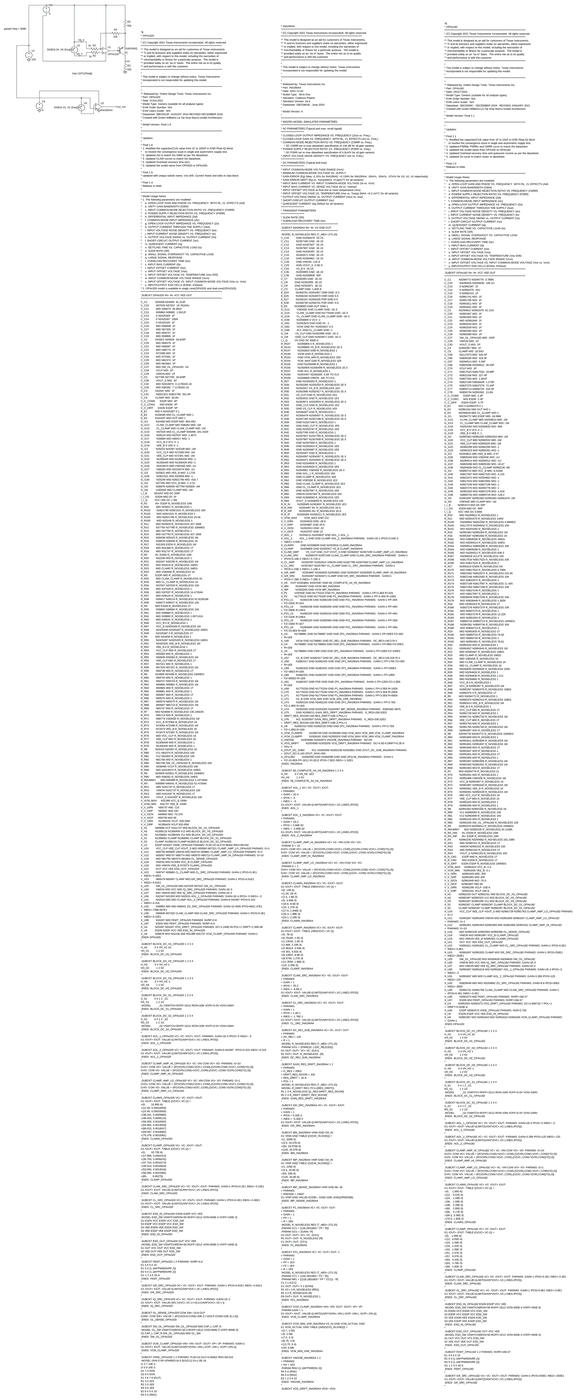
[diagram p0: schematic high_common_mode_shunt_opa320_bjt.asc, whole sheet]
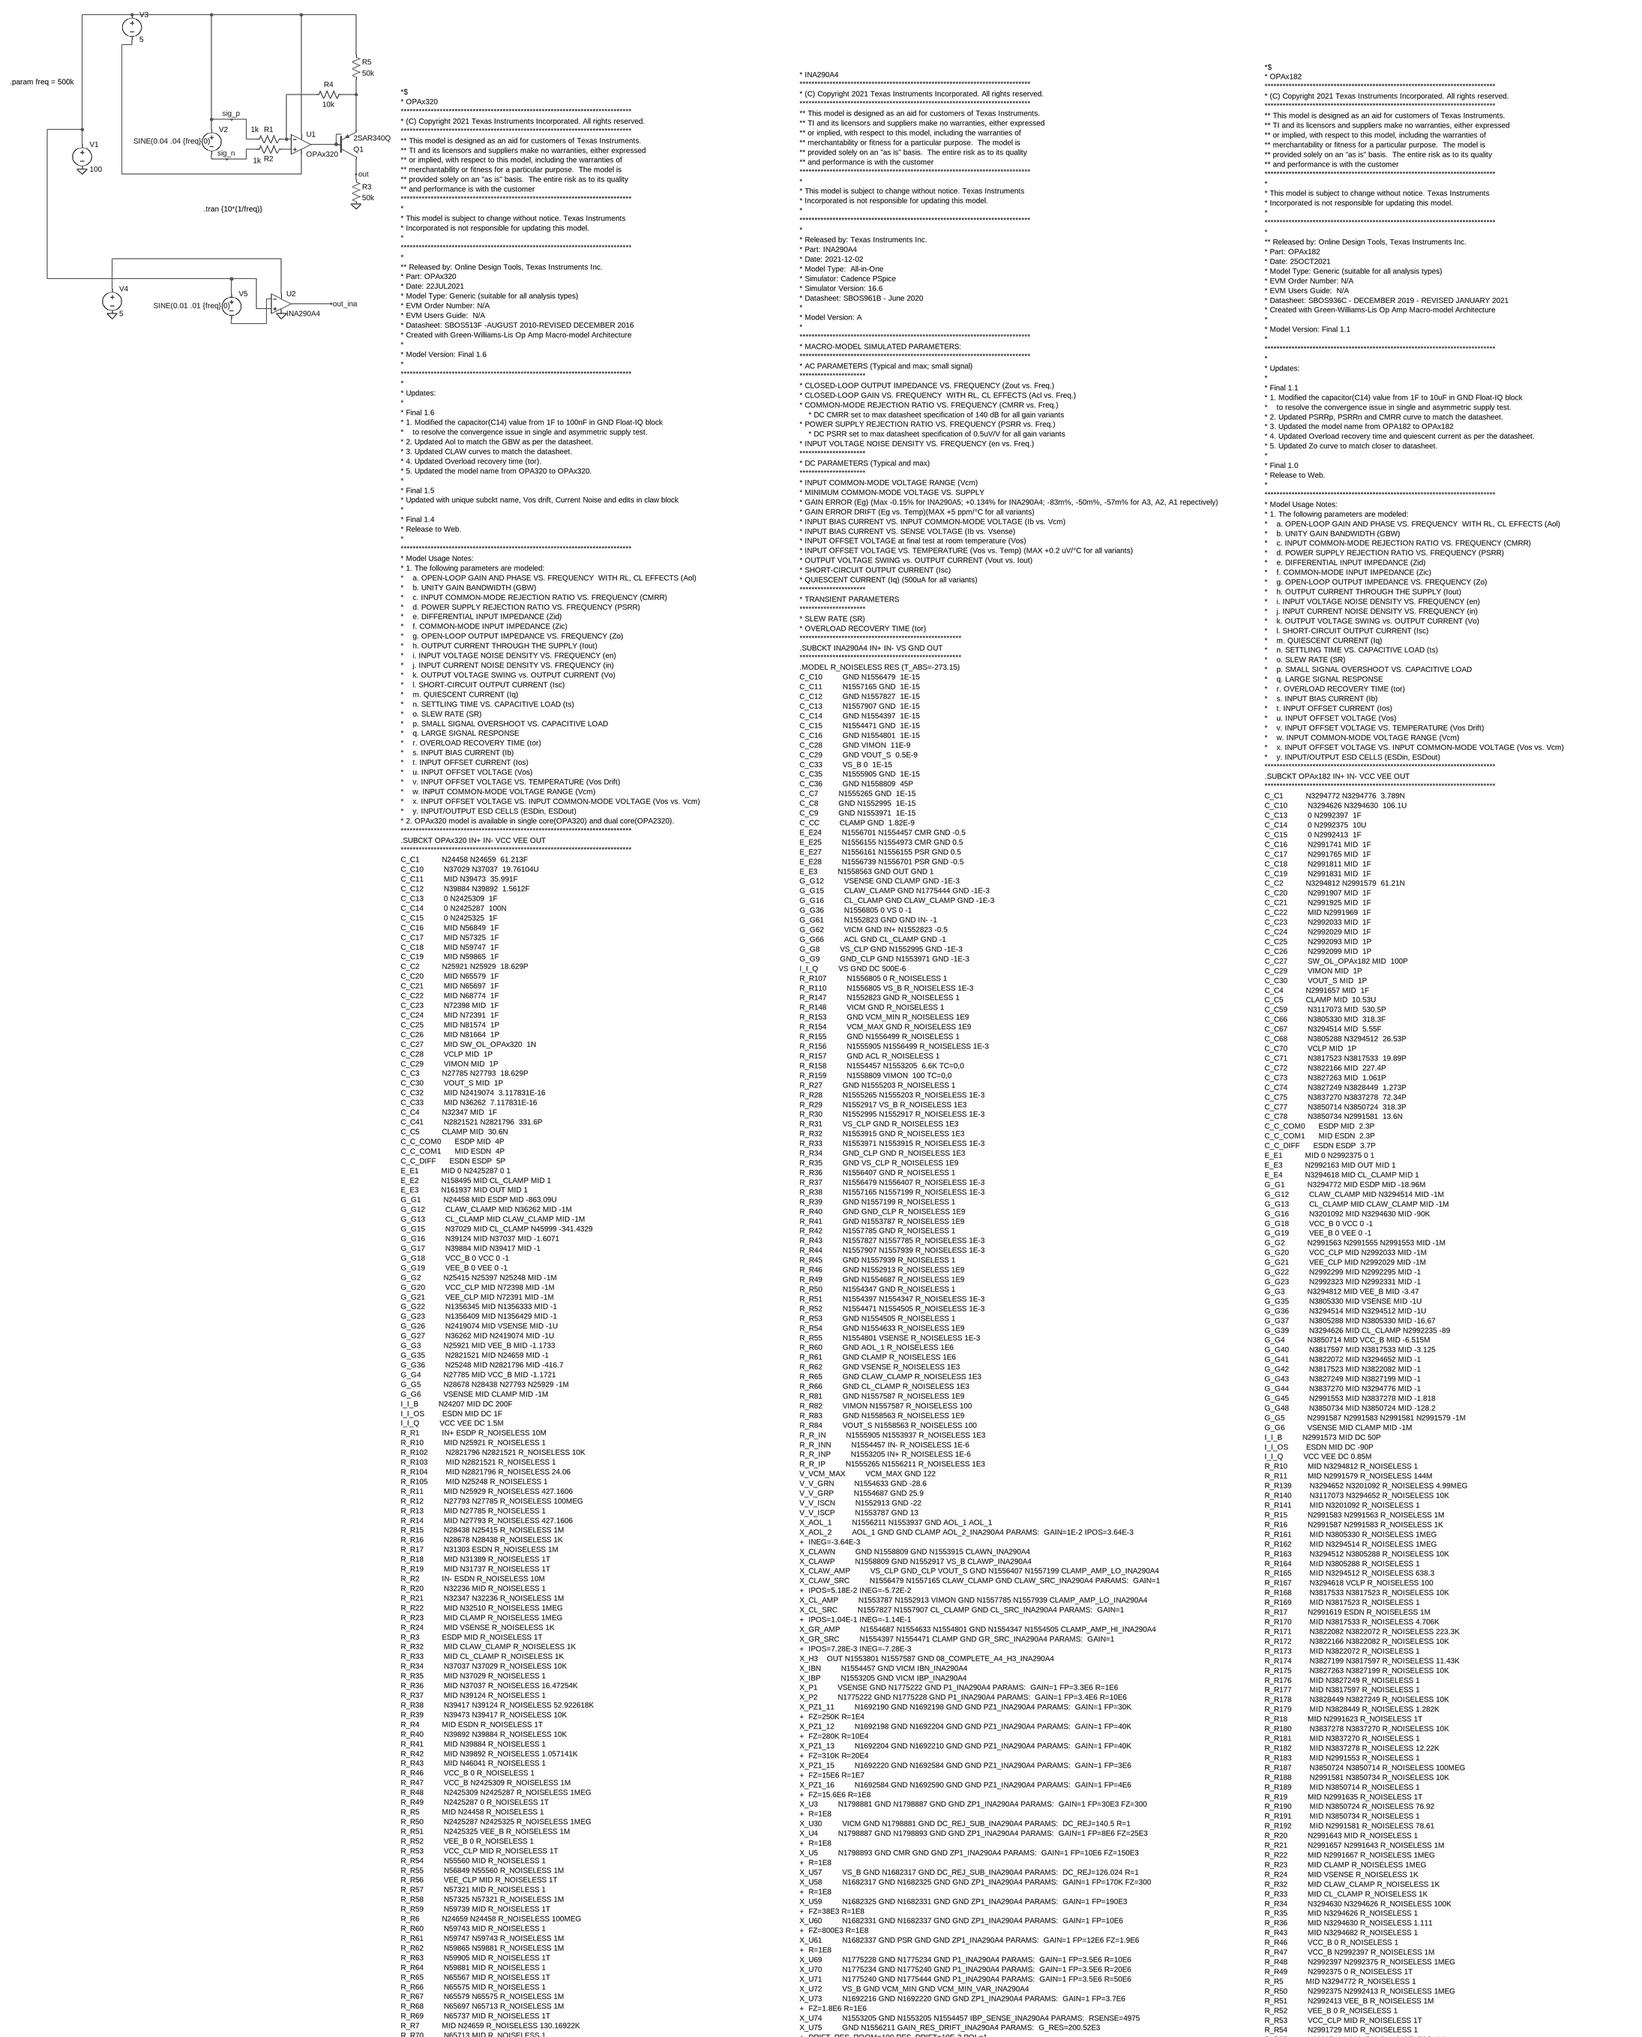
[diagram p1: schematic high_common_mode_shunt_opa320_bjt.asc, part, row 1 of 2, column 1 of 1]
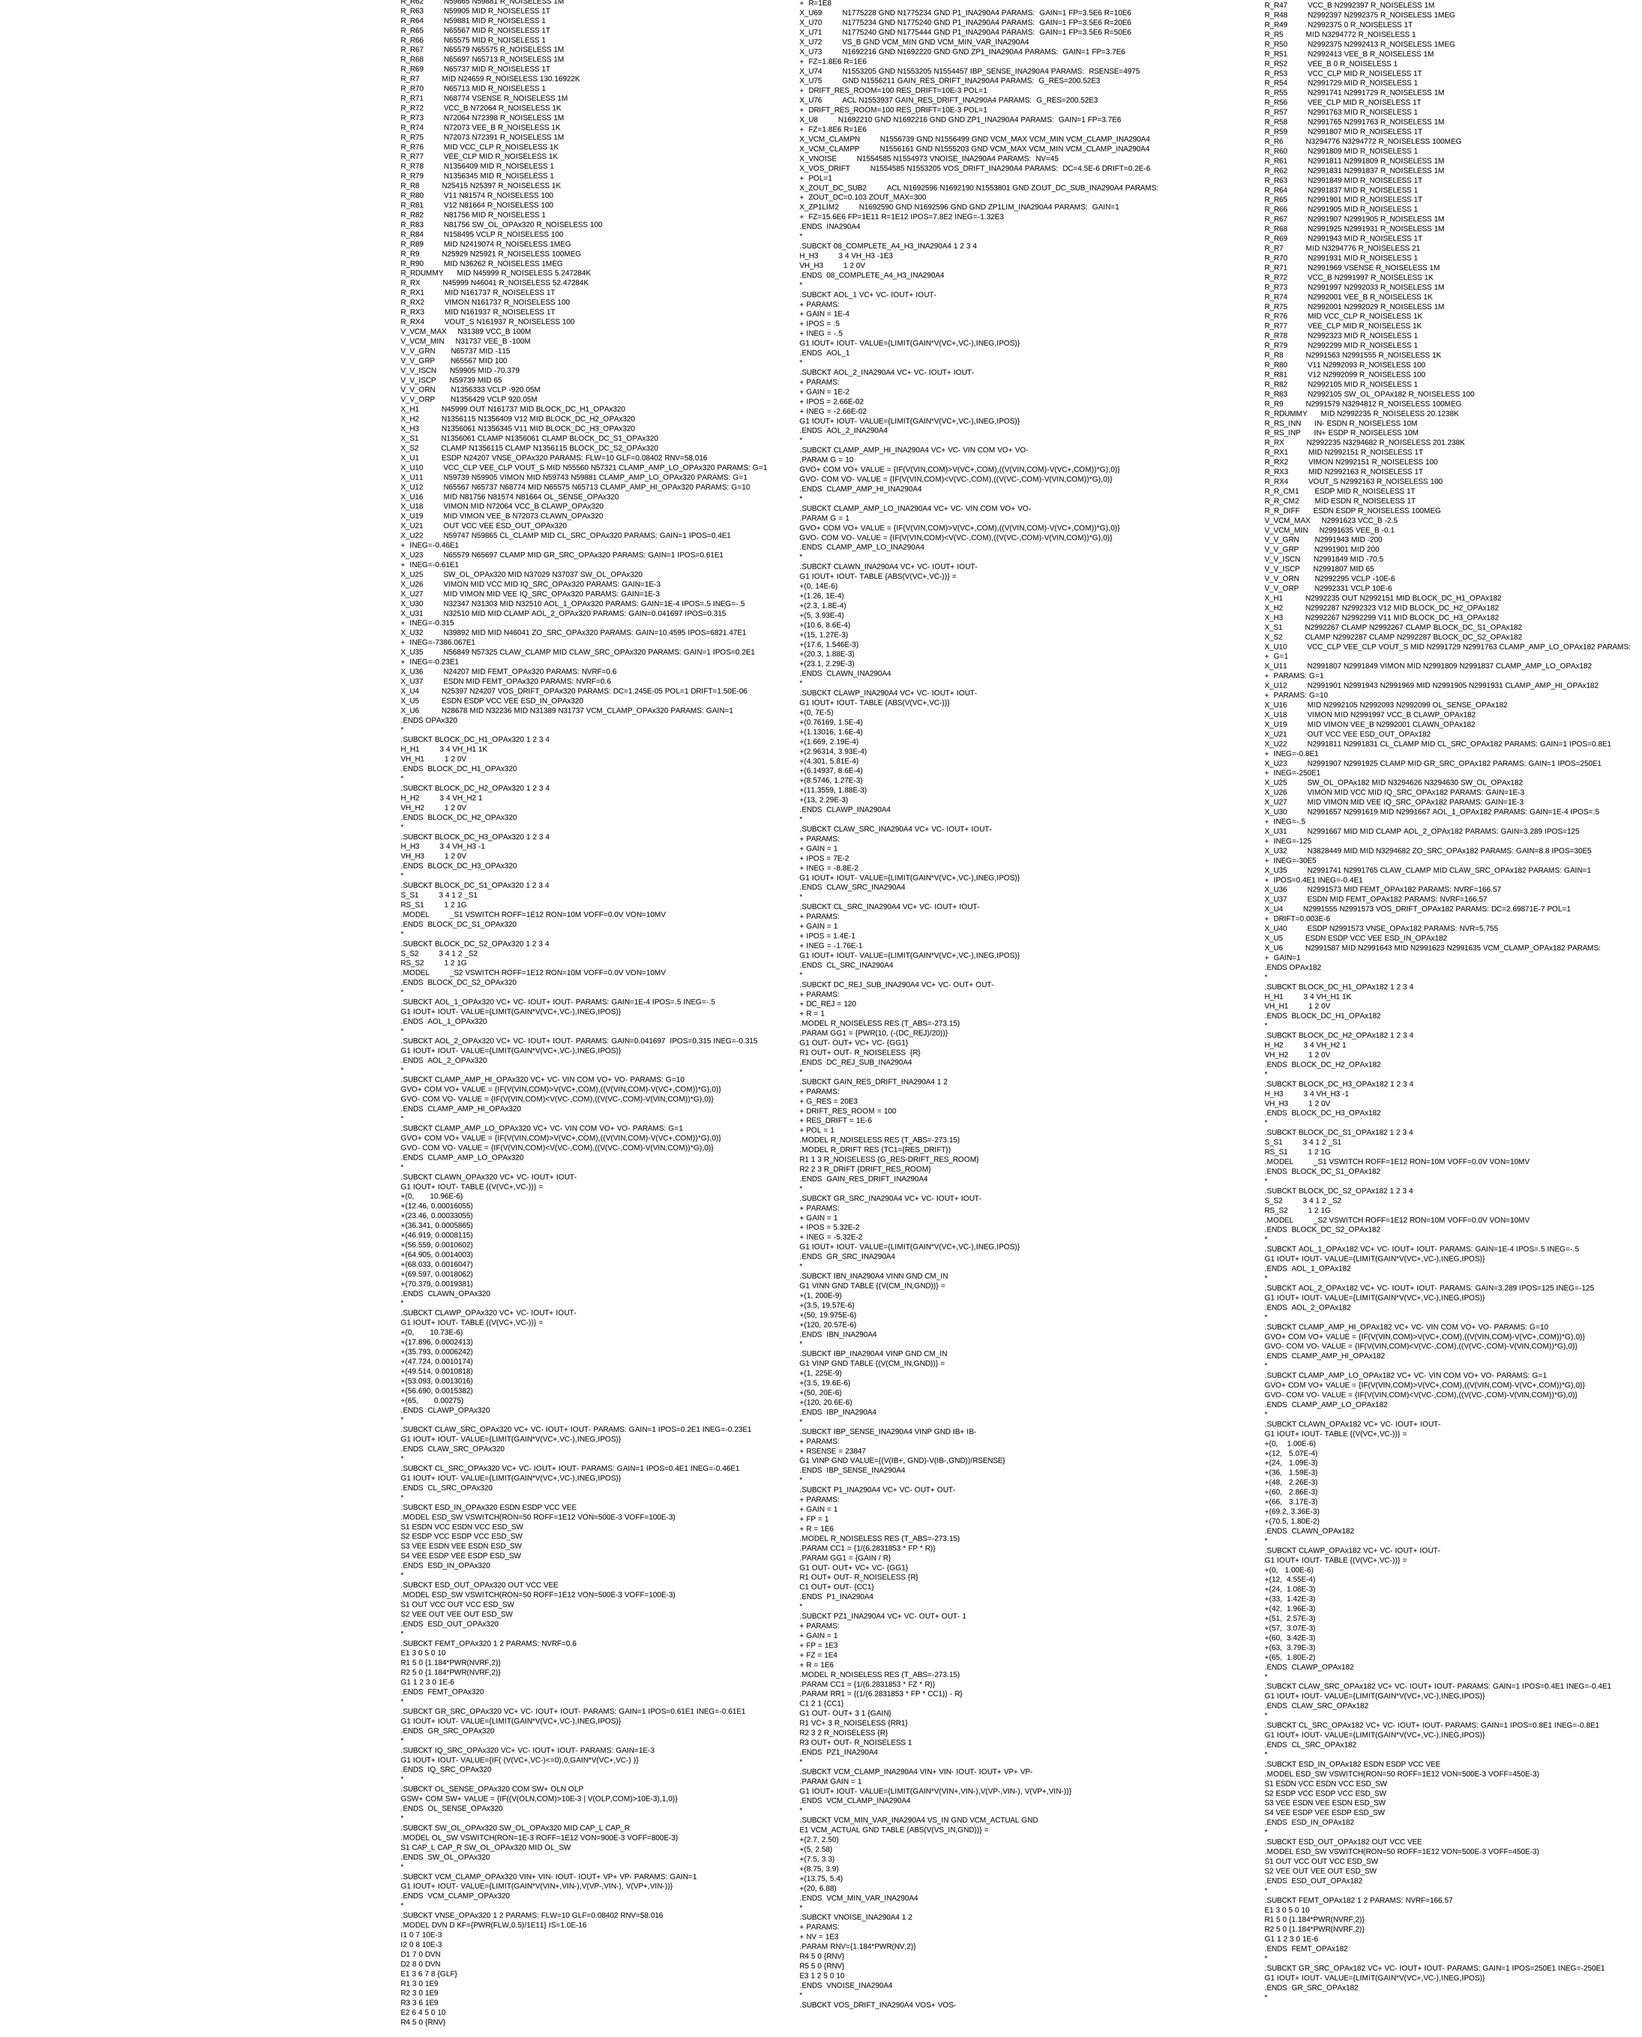
[diagram p2: schematic high_common_mode_shunt_opa320_bjt.asc, part, row 2 of 2, column 1 of 1]
* high_common_mode_shunt_opa320_bjt.asc
XU1 N005 N002 sig_p N001 N004 OPAx320  ; pins In+ In- V+ V- OUT
R1 N002 sig_p 1k
R2 N005 sig_n 1k
V1 sig_p 0 100
V2 sig_p sig_n SINE(0.04 .04 {freq} 0)
R4 N003 N002 10k
V3 sig_p N001 5
R3 out 0 50k
R5 sig_p N003 50k
Q1 out N004 N003 0 2SAR340Q
XU2 sig_p N007 N006 0 out_ina INA290A4  ; pins In+ In- V+ V- OUT
V4 N006 0 5
V5 sig_p N007 SINE(0.01 .01 {freq} 0)
.model NPN NPN
.model PNP PNP
.lib standard.bjt
*$
* OPAx320
*****************************************************************************
* (C) Copyright 2021 Texas Instruments Incorporated. All rights reserved.
*****************************************************************************
** This model is designed as an aid for customers of Texas Instruments.
** TI and its licensors and suppliers make no warranties, either expressed
** or implied, with respect to this model, including the warranties of
** merchantability or fitness for a particular purpose.  The model is
** provided solely on an "as is" basis.  The entire risk as to its quality
** and performance is with the customer
*****************************************************************************
*
* This model is subject to change without notice. Texas Instruments
* Incorporated is not responsible for updating this model.
*
*****************************************************************************
*
** Released by: Online Design Tools, Texas Instruments Inc.
* Part: OPAx320
* Date: 22JUL2021
* Model Type: Generic (suitable for all analysis types)
* EVM Order Number: N/A
* EVM Users Guide:  N/A
* Datasheet: SBOS513F -AUGUST 2010-REVISED DECEMBER 2016
* Created with Green-Williams-Lis Op Amp Macro-model Architecture
*
* Model Version: Final 1.6
*
*****************************************************************************
*
* Updates:
*
* Final 1.6
* 1. Modified the capacitor(C14) value from 1F to 100nF in GND Float-IQ block
*    to resolve the convergence issue in single and asymmetric supply test.
* 2. Updated Aol to match the GBW as per the datasheet.
* 3. Updated CLAW curves to match the datasheet.
* 4. Updated Overload recovery time (tor).
* 5. Updated the model name from OPA320 to OPAx320.
*
* Final 1.5
* Updated with unique subckt name, Vos drift, Current Noise and edits in claw block
*
* Final 1.4
* Release to Web.
*
*****************************************************************************
* Model Usage Notes:
* 1. The following parameters are modeled:
*    a. OPEN-LOOP GAIN AND PHASE VS. FREQUENCY  WITH RL, CL EFFECTS (Aol)
*    b. UNITY GAIN BANDWIDTH (GBW)
*    c. INPUT COMMON-MODE REJECTION RATIO VS. FREQUENCY (CMRR)
*    d. POWER SUPPLY REJECTION RATIO VS. FREQUENCY (PSRR)
*    e. DIFFERENTIAL INPUT IMPEDANCE (Zid)
*    f. COMMON-MODE INPUT IMPEDANCE (Zic)
*    g. OPEN-LOOP OUTPUT IMPEDANCE VS. FREQUENCY (Zo)
*    h. OUTPUT CURRENT THROUGH THE SUPPLY (Iout)
*    i. INPUT VOLTAGE NOISE DENSITY VS. FREQUENCY (en)
*    j. INPUT CURRENT NOISE DENSITY VS. FREQUENCY (in)
*    k. OUTPUT VOLTAGE SWING vs. OUTPUT CURRENT (Vo)
*    l. SHORT-CIRCUIT OUTPUT CURRENT (Isc)
*    m. QUIESCENT CURRENT (Iq)
*    n. SETTLING TIME VS. CAPACITIVE LOAD (ts)
*    o. SLEW RATE (SR)
*    p. SMALL SIGNAL OVERSHOOT VS. CAPACITIVE LOAD
*    q. LARGE SIGNAL RESPONSE
*    r. OVERLOAD RECOVERY TIME (tor)
*    s. INPUT BIAS CURRENT (Ib)
*    t. INPUT OFFSET CURRENT (Ios)
*    u. INPUT OFFSET VOLTAGE (Vos)
*    v. INPUT OFFSET VOLTAGE VS. TEMPERATURE (Vos Drift)
*    w. INPUT COMMON-MODE VOLTAGE RANGE (Vcm)
*    x. INPUT OFFSET VOLTAGE VS. INPUT COMMON-MODE VOLTAGE (Vos vs. Vcm)
*    y. INPUT/OUTPUT ESD CELLS (ESDin, ESDout)
* 2. OPAx320 model is available in single core(OPA320) and dual core(OPA2320).
*****************************************************************************
.SUBCKT OPAx320 IN+ IN- VCC VEE OUT
*****************************************************************************
C_C1          N24458 N24659  61.213F
C_C10         N37029 N37037  19.76104U
C_C11         MID N39473  35.991F
C_C12         N39884 N39892  1.5612F
C_C13         0 N2425309  1F
C_C14         0 N2425287  100N
C_C15         0 N2425325  1F
C_C16         MID N56849  1F
C_C17         MID N57325  1F
C_C18         MID N59747  1F
C_C19         MID N59865  1F
C_C2          N25921 N25929  18.629P
C_C20         MID N65579  1F
C_C21         MID N65697  1F
C_C22         MID N68774  1F
C_C23         N72398 MID  1F
C_C24         MID N72391  1F
C_C25         MID N81574  1P
C_C26         MID N81664  1P
C_C27         MID SW_OL_OPAx320  1N
C_C28         VCLP MID  1P
C_C29         VIMON MID  1P
C_C3          N27785 N27793  18.629P
C_C30         VOUT_S MID  1P
C_C32         MID N2419074  3.117831E-16
C_C33         MID N36262  7.117831E-16
C_C4          N32347 MID  1F
C_C41         N2821521 N2821796  331.6P
C_C5          CLAMP MID  30.6N
C_C_COM0      ESDP MID  4P
C_C_COM1      MID ESDN  4P
C_C_DIFF      ESDN ESDP  5P
E_E1          MID 0 N2425287 0 1
E_E2          N158495 MID CL_CLAMP MID 1
E_E3          N161937 MID OUT MID 1
G_G1          N24458 MID ESDP MID -863.09U
G_G12         CLAW_CLAMP MID N36262 MID -1M
G_G13         CL_CLAMP MID CLAW_CLAMP MID -1M
G_G15         N37029 MID CL_CLAMP N45999 -341.4329
G_G16         N39124 MID N37037 MID -1.6071
G_G17         N39884 MID N39417 MID -1
G_G18         VCC_B 0 VCC 0 -1
G_G19         VEE_B 0 VEE 0 -1
G_G2          N25415 N25397 N25248 MID -1M
G_G20         VCC_CLP MID N72398 MID -1M
G_G21         VEE_CLP MID N72391 MID -1M
G_G22         N1356345 MID N1356333 MID -1
G_G23         N1356409 MID N1356429 MID -1
G_G26         N2419074 MID VSENSE MID -1U
G_G27         N36262 MID N2419074 MID -1U
G_G3          N25921 MID VEE_B MID -1.1733
G_G35         N2821521 MID N24659 MID -1
G_G36         N25248 MID N2821796 MID -416.7
G_G4          N27785 MID VCC_B MID -1.1721
G_G5          N28678 N28438 N27793 N25929 -1M
G_G6          VSENSE MID CLAMP MID -1M
I_I_B         N24207 MID DC 200F
I_I_OS        ESDN MID DC 1F
I_I_Q         VCC VEE DC 1.5M
R_R1          IN+ ESDP R_NOISELESS 10M
R_R10         MID N25921 R_NOISELESS 1
R_R102        N2821796 N2821521 R_NOISELESS 10K
R_R103        MID N2821521 R_NOISELESS 1
R_R104        MID N2821796 R_NOISELESS 24.06
R_R105        MID N25248 R_NOISELESS 1
R_R11         MID N25929 R_NOISELESS 427.1606
R_R12         N27793 N27785 R_NOISELESS 100MEG
R_R13         MID N27785 R_NOISELESS 1
R_R14         MID N27793 R_NOISELESS 427.1606
R_R15         N28438 N25415 R_NOISELESS 1M
R_R16         N28678 N28438 R_NOISELESS 1K
R_R17         N31303 ESDN R_NOISELESS 1M
R_R18         MID N31389 R_NOISELESS 1T
R_R19         MID N31737 R_NOISELESS 1T
R_R2          IN- ESDN R_NOISELESS 10M
R_R20         N32236 MID R_NOISELESS 1
R_R21         N32347 N32236 R_NOISELESS 1M
R_R22         MID N32510 R_NOISELESS 1MEG
R_R23         MID CLAMP R_NOISELESS 1MEG
R_R24         MID VSENSE R_NOISELESS 1K
R_R3          ESDP MID R_NOISELESS 1T
R_R32         MID CLAW_CLAMP R_NOISELESS 1K
R_R33         MID CL_CLAMP R_NOISELESS 1K
R_R34         N37037 N37029 R_NOISELESS 10K
R_R35         MID N37029 R_NOISELESS 1
R_R36         MID N37037 R_NOISELESS 16.47254K
R_R37         MID N39124 R_NOISELESS 1
R_R38         N39417 N39124 R_NOISELESS 52.922618K
R_R39         N39473 N39417 R_NOISELESS 10K
R_R4          MID ESDN R_NOISELESS 1T
R_R40         N39892 N39884 R_NOISELESS 10K
R_R41         MID N39884 R_NOISELESS 1
R_R42         MID N39892 R_NOISELESS 1.057141K
R_R43         MID N46041 R_NOISELESS 1
R_R46         VCC_B 0 R_NOISELESS 1
R_R47         VCC_B N2425309 R_NOISELESS 1M
R_R48         N2425309 N2425287 R_NOISELESS 1MEG
R_R49         N2425287 0 R_NOISELESS 1T
R_R5          MID N24458 R_NOISELESS 1
R_R50         N2425287 N2425325 R_NOISELESS 1MEG
R_R51         N2425325 VEE_B R_NOISELESS 1M
R_R52         VEE_B 0 R_NOISELESS 1
R_R53         VCC_CLP MID R_NOISELESS 1T
R_R54         N55560 MID R_NOISELESS 1
R_R55         N56849 N55560 R_NOISELESS 1M
R_R56         VEE_CLP MID R_NOISELESS 1T
R_R57         N57321 MID R_NOISELESS 1
R_R58         N57325 N57321 R_NOISELESS 1M
R_R59         N59739 MID R_NOISELESS 1T
R_R6          N24659 N24458 R_NOISELESS 100MEG
R_R60         N59743 MID R_NOISELESS 1
R_R61         N59747 N59743 R_NOISELESS 1M
R_R62         N59865 N59881 R_NOISELESS 1M
R_R63         N59905 MID R_NOISELESS 1T
R_R64         N59881 MID R_NOISELESS 1
R_R65         N65567 MID R_NOISELESS 1T
R_R66         N65575 MID R_NOISELESS 1
R_R67         N65579 N65575 R_NOISELESS 1M
R_R68         N65697 N65713 R_NOISELESS 1M
R_R69         N65737 MID R_NOISELESS 1T
R_R7          MID N24659 R_NOISELESS 130.16922K
R_R70         N65713 MID R_NOISELESS 1
R_R71         N68774 VSENSE R_NOISELESS 1M
R_R72         VCC_B N72064 R_NOISELESS 1K
R_R73         N72064 N72398 R_NOISELESS 1M
R_R74         N72073 VEE_B R_NOISELESS 1K
R_R75         N72073 N72391 R_NOISELESS 1M
R_R76         MID VCC_CLP R_NOISELESS 1K
R_R77         VEE_CLP MID R_NOISELESS 1K
R_R78         N1356409 MID R_NOISELESS 1
R_R79         N1356345 MID R_NOISELESS 1
R_R8          N25415 N25397 R_NOISELESS 1K
R_R80         V11 N81574 R_NOISELESS 100
R_R81         V12 N81664 R_NOISELESS 100
R_R82         N81756 MID R_NOISELESS 1
R_R83         N81756 SW_OL_OPAx320 R_NOISELESS 100
R_R84         N158495 VCLP R_NOISELESS 100
R_R89         MID N2419074 R_NOISELESS 1MEG
R_R9          N25929 N25921 R_NOISELESS 100MEG
R_R90         MID N36262 R_NOISELESS 1MEG
R_RDUMMY      MID N45999 R_NOISELESS 5.247284K
R_RX          N45999 N46041 R_NOISELESS 52.47284K
R_RX1         MID N161737 R_NOISELESS 1T
R_RX2         VIMON N161737 R_NOISELESS 100
R_RX3         MID N161937 R_NOISELESS 1T
R_RX4         VOUT_S N161937 R_NOISELESS 100
V_VCM_MAX     N31389 VCC_B 100M
V_VCM_MIN     N31737 VEE_B -100M
V_V_GRN       N65737 MID -115
V_V_GRP       N65567 MID 100
V_V_ISCN      N59905 MID -70.379
V_V_ISCP      N59739 MID 65
V_V_ORN       N1356333 VCLP -920.05M
V_V_ORP       N1356429 VCLP 920.05M
X_H1          N45999 OUT N161737 MID BLOCK_DC_H1_OPAx320
X_H2          N1356115 N1356409 V12 MID BLOCK_DC_H2_OPAx320
X_H3          N1356061 N1356345 V11 MID BLOCK_DC_H3_OPAx320
X_S1          N1356061 CLAMP N1356061 CLAMP BLOCK_DC_S1_OPAx320
X_S2          CLAMP N1356115 CLAMP N1356115 BLOCK_DC_S2_OPAx320
X_U1          ESDP N24207 VNSE_OPAx320 PARAMS: FLW=10 GLF=0.08402 RNV=58.016
X_U10         VCC_CLP VEE_CLP VOUT_S MID N55560 N57321 CLAMP_AMP_LO_OPAx320 PARAMS: G=1
X_U11         N59739 N59905 VIMON MID N59743 N59881 CLAMP_AMP_LO_OPAx320 PARAMS: G=1
X_U12         N65567 N65737 N68774 MID N65575 N65713 CLAMP_AMP_HI_OPAx320 PARAMS: G=10
X_U16         MID N81756 N81574 N81664 OL_SENSE_OPAx320
X_U18         VIMON MID N72064 VCC_B CLAWP_OPAx320
X_U19         MID VIMON VEE_B N72073 CLAWN_OPAx320
X_U21         OUT VCC VEE ESD_OUT_OPAx320
X_U22         N59747 N59865 CL_CLAMP MID CL_SRC_OPAx320 PARAMS: GAIN=1 IPOS=0.4E1
+  INEG=-0.46E1
X_U23         N65579 N65697 CLAMP MID GR_SRC_OPAx320 PARAMS: GAIN=1 IPOS=0.61E1
+  INEG=-0.61E1
X_U25         SW_OL_OPAx320 MID N37029 N37037 SW_OL_OPAx320
X_U26         VIMON MID VCC MID IQ_SRC_OPAx320 PARAMS: GAIN=1E-3
X_U27         MID VIMON MID VEE IQ_SRC_OPAx320 PARAMS: GAIN=1E-3
X_U30         N32347 N31303 MID N32510 AOL_1_OPAx320 PARAMS: GAIN=1E-4 IPOS=.5 INEG=-.5
X_U31         N32510 MID MID CLAMP AOL_2_OPAx320 PARAMS: GAIN=0.041697 IPOS=0.315
+  INEG=-0.315
X_U32         N39892 MID MID N46041 ZO_SRC_OPAx320 PARAMS: GAIN=10.4595 IPOS=6821.47E1
+  INEG=-7386.067E1
X_U35         N56849 N57325 CLAW_CLAMP MID CLAW_SRC_OPAx320 PARAMS: GAIN=1 IPOS=0.2E1
+  INEG=-0.23E1
X_U36         N24207 MID FEMT_OPAx320 PARAMS: NVRF=0.6
X_U37         ESDN MID FEMT_OPAx320 PARAMS: NVRF=0.6
X_U4          N25397 N24207 VOS_DRIFT_OPAx320 PARAMS: DC=1.245E-05 POL=1 DRIFT=1.50E-06
X_U5          ESDN ESDP VCC VEE ESD_IN_OPAx320
X_U6          N28678 MID N32236 MID N31389 N31737 VCM_CLAMP_OPAx320 PARAMS: GAIN=1
.ENDS OPAx320
*
.SUBCKT BLOCK_DC_H1_OPAx320 1 2 3 4
H_H1         3 4 VH_H1 1K
VH_H1         1 2 0V
.ENDS  BLOCK_DC_H1_OPAx320
*
.SUBCKT BLOCK_DC_H2_OPAx320 1 2 3 4
H_H2         3 4 VH_H2 1
VH_H2         1 2 0V
.ENDS  BLOCK_DC_H2_OPAx320
*
.SUBCKT BLOCK_DC_H3_OPAx320 1 2 3 4
H_H3         3 4 VH_H3 -1
VH_H3         1 2 0V
.ENDS  BLOCK_DC_H3_OPAx320
*
.SUBCKT BLOCK_DC_S1_OPAx320 1 2 3 4
S_S1         3 4 1 2 _S1
RS_S1         1 2 1G
.MODEL         _S1 VSWITCH ROFF=1E12 RON=10M VOFF=0.0V VON=10MV
.ENDS  BLOCK_DC_S1_OPAx320
*
.SUBCKT BLOCK_DC_S2_OPAx320 1 2 3 4
S_S2         3 4 1 2 _S2
RS_S2         1 2 1G
.MODEL         _S2 VSWITCH ROFF=1E12 RON=10M VOFF=0.0V VON=10MV
.ENDS  BLOCK_DC_S2_OPAx320
*
.SUBCKT AOL_1_OPAx320 VC+ VC- IOUT+ IOUT- PARAMS: GAIN=1E-4 IPOS=.5 INEG=-.5
G1 IOUT+ IOUT- VALUE={LIMIT(GAIN*V(VC+,VC-),INEG,IPOS)}
.ENDS  AOL_1_OPAx320
*
.SUBCKT AOL_2_OPAx320 VC+ VC- IOUT+ IOUT- PARAMS: GAIN=0.041697  IPOS=0.315 INEG=-0.315
G1 IOUT+ IOUT- VALUE={LIMIT(GAIN*V(VC+,VC-),INEG,IPOS)}
.ENDS  AOL_2_OPAx320
*
.SUBCKT CLAMP_AMP_HI_OPAx320 VC+ VC- VIN COM VO+ VO- PARAMS: G=10
GVO+ COM VO+ VALUE = {IF(V(VIN,COM)>V(VC+,COM),((V(VIN,COM)-V(VC+,COM))*G),0)}
GVO- COM VO- VALUE = {IF(V(VIN,COM)<V(VC-,COM),((V(VC-,COM)-V(VIN,COM))*G),0)}
.ENDS  CLAMP_AMP_HI_OPAx320
*
.SUBCKT CLAMP_AMP_LO_OPAx320 VC+ VC- VIN COM VO+ VO- PARAMS: G=1
GVO+ COM VO+ VALUE = {IF(V(VIN,COM)>V(VC+,COM),((V(VIN,COM)-V(VC+,COM))*G),0)}
GVO- COM VO- VALUE = {IF(V(VIN,COM)<V(VC-,COM),((V(VC-,COM)-V(VIN,COM))*G),0)}
.ENDS  CLAMP_AMP_LO_OPAx320
*
.SUBCKT CLAWN_OPAx320 VC+ VC- IOUT+ IOUT-
G1 IOUT+ IOUT- TABLE {(V(VC+,VC-))} =
+(0,       10.96E-6)
+(12.46, 0.00016055)
+(23.46, 0.00033055)
+(36.341, 0.0005865)
+(46.919, 0.0008115)
+(56.559, 0.0010602)
+(64.905, 0.0014003)
+(68.033, 0.0016047)
+(69.597, 0.0018062)
+(70.379, 0.0019381)
.ENDS  CLAWN_OPAx320
*
.SUBCKT CLAWP_OPAx320 VC+ VC- IOUT+ IOUT-
G1 IOUT+ IOUT- TABLE {(V(VC+,VC-))} =
+(0,       10.73E-6)
+(17.896, 0.0002413)
+(35.793, 0.0006242)
+(47.724, 0.0010174)
+(49.514, 0.0010818)
+(53.093, 0.0013016)
+(56.690, 0.0015382)
+(65,       0.00275)
.ENDS  CLAWP_OPAx320
*
.SUBCKT CLAW_SRC_OPAx320 VC+ VC- IOUT+ IOUT- PARAMS: GAIN=1 IPOS=0.2E1 INEG=-0.23E1
G1 IOUT+ IOUT- VALUE={LIMIT(GAIN*V(VC+,VC-),INEG,IPOS)}
.ENDS  CLAW_SRC_OPAx320
*
.SUBCKT CL_SRC_OPAx320 VC+ VC- IOUT+ IOUT- PARAMS: GAIN=1 IPOS=0.4E1 INEG=-0.46E1
G1 IOUT+ IOUT- VALUE={LIMIT(GAIN*V(VC+,VC-),INEG,IPOS)}
.ENDS  CL_SRC_OPAx320
*
.SUBCKT ESD_IN_OPAx320 ESDN ESDP VCC VEE
.MODEL ESD_SW VSWITCH(RON=50 ROFF=1E12 VON=500E-3 VOFF=100E-3)
S1 ESDN VCC ESDN VCC ESD_SW
S2 ESDP VCC ESDP VCC ESD_SW
S3 VEE ESDN VEE ESDN ESD_SW
S4 VEE ESDP VEE ESDP ESD_SW
.ENDS  ESD_IN_OPAx320
*
.SUBCKT ESD_OUT_OPAx320 OUT VCC VEE
.MODEL ESD_SW VSWITCH(RON=50 ROFF=1E12 VON=500E-3 VOFF=100E-3)
S1 OUT VCC OUT VCC ESD_SW
S2 VEE OUT VEE OUT ESD_SW
.ENDS  ESD_OUT_OPAx320
*
.SUBCKT FEMT_OPAx320 1 2 PARAMS: NVRF=0.6
E1 3 0 5 0 10
R1 5 0 {1.184*PWR(NVRF,2)}
R2 5 0 {1.184*PWR(NVRF,2)}
G1 1 2 3 0 1E-6
.ENDS  FEMT_OPAx320
*
.SUBCKT GR_SRC_OPAx320 VC+ VC- IOUT+ IOUT- PARAMS: GAIN=1 IPOS=0.61E1 INEG=-0.61E1
G1 IOUT+ IOUT- VALUE={LIMIT(GAIN*V(VC+,VC-),INEG,IPOS)}
.ENDS  GR_SRC_OPAx320
*
.SUBCKT IQ_SRC_OPAx320 VC+ VC- IOUT+ IOUT- PARAMS: GAIN=1E-3
G1 IOUT+ IOUT- VALUE={IF( (V(VC+,VC-)<=0),0,GAIN*V(VC+,VC-) )}
.ENDS  IQ_SRC_OPAx320
*
.SUBCKT OL_SENSE_OPAx320 COM SW+ OLN OLP
GSW+ COM SW+ VALUE = {IF((V(OLN,COM)>10E-3 | V(OLP,COM)>10E-3),1,0)}
.ENDS  OL_SENSE_OPAx320
*
.SUBCKT SW_OL_OPAx320 SW_OL_OPAx320 MID CAP_L CAP_R
.MODEL OL_SW VSWITCH(RON=1E-3 ROFF=1E12 VON=900E-3 VOFF=800E-3)
S1 CAP_L CAP_R SW_OL_OPAx320 MID OL_SW
.ENDS  SW_OL_OPAx320
*
.SUBCKT VCM_CLAMP_OPAx320 VIN+ VIN- IOUT- IOUT+ VP+ VP- PARAMS: GAIN=1
G1 IOUT+ IOUT- VALUE={LIMIT(GAIN*V(VIN+,VIN-),V(VP-,VIN-), V(VP+,VIN-))}
.ENDS  VCM_CLAMP_OPAx320
*
.SUBCKT VNSE_OPAx320 1 2 PARAMS: FLW=10 GLF=0.08402 RNV=58.016
.MODEL DVN D KF={PWR(FLW,0.5)/1E11} IS=1.0E-16
I1 0 7 10E-3
I2 0 8 10E-3
D1 7 0 DVN
D2 8 0 DVN
E1 3 6 7 8 {GLF}
R1 3 0 1E9
R2 3 0 1E9
R3 3 6 1E9
E2 6 4 5 0 10
R4 5 0 {RNV}
R5 5 0 {RNV}
R6 3 4 1E9
R7 4 0 1E9
E3 1 2 3 4 1
.ENDS  VNSE_OPAx320
*
.SUBCKT VOS_DRIFT_OPAx320 VOS+ VOS- PARAMS: DC=1.243E-05 POL=1 DRIFT=1.50E-06
E1 VOS+ VOS- VALUE={DC+POL*DRIFT*(TEMP-27)}
.ENDS  VOS_DRIFT_OPAx320
*
.SUBCKT ZO_SRC_OPAx320 VC+ VC- IOUT+ IOUT- PARAMS: GAIN=10.4595 IPOS=6821.47E1 INEG=-7386.067E1
G1 IOUT+ IOUT- VALUE={LIMIT(GAIN*V(VC+,VC-),INEG,IPOS)}
.ENDS  ZO_SRC_OPAx320
*
.MODEL R_NOISELESS RES (T_ABS=-273.15)
*
.tran {10*(1/freq)}
.param freq = 500k
* INA290A4
*****************************************************************************
* (C) Copyright 2021 Texas Instruments Incorporated. All rights reserved.
*****************************************************************************
** This model is designed as an aid for customers of Texas Instruments.
** TI and its licensors and suppliers make no warranties, either expressed
** or implied, with respect to this model, including the warranties of
** merchantability or fitness for a particular purpose.  The model is
** provided solely on an "as is" basis.  The entire risk as to its quality
** and performance is with the customer
*****************************************************************************
*
* This model is subject to change without notice. Texas Instruments
* Incorporated is not responsible for updating this model.
*
*****************************************************************************
*
* Released by: Texas Instruments Inc.
* Part: INA290A4
* Date: 2021-12-02
* Model Type:  All-in-One
* Simulator: Cadence PSpice
* Simulator Version: 16.6
* Datasheet: SBOS961B - June 2020
*
* Model Version: A
*
*****************************************************************************
* MACRO-MODEL SIMULATED PARAMETERS:
*****************************************************************************
* AC PARAMETERS (Typical and max; small signal)
**********************
* CLOSED-LOOP OUTPUT IMPEDANCE VS. FREQUENCY (Zout vs. Freq.)
* CLOSED-LOOP GAIN VS. FREQUENCY  WITH RL, CL EFFECTS (Acl vs. Freq.)
* COMMON-MODE REJECTION RATIO VS. FREQUENCY (CMRR vs. Freq.)
    * DC CMRR set to max datasheet specification of 140 dB for all gain variants
* POWER SUPPLY REJECTION RATIO VS. FREQUENCY (PSRR vs. Freq.)
    * DC PSRR set to max datasheet specification of 0.5uV/V for all gain variants
* INPUT VOLTAGE NOISE DENSITY VS. FREQUENCY (en vs. Freq.)
**********************
* DC PARAMETERS (Typical and max)
**********************
* INPUT COMMON-MODE VOLTAGE RANGE (Vcm)
* MINIMUM COMMON-MODE VOLTAGE VS. SUPPLY
* GAIN ERROR (Eg) (Max -0.15% for INA290A5; +0.134% for INA290A4; -83m%, -50m%, -57m% for A3, A2, A1 repectively)
* GAIN ERROR DRIFT (Eg vs. Temp)(MAX +5 ppm/°C for all variants)
* INPUT BIAS CURRENT VS. INPUT COMMON-MODE VOLTAGE (Ib vs. Vcm)
* INPUT BIAS CURRENT VS. SENSE VOLTAGE (Ib vs. Vsense)
* INPUT OFFSET VOLTAGE at final test at room temperature (Vos)
* INPUT OFFSET VOLTAGE VS. TEMPERATURE (Vos vs. Temp) (MAX +0.2 uV/°C for all variants)
* OUTPUT VOLTAGE SWING vs. OUTPUT CURRENT (Vout vs. Iout)
* SHORT-CIRCUIT OUTPUT CURRENT (Isc)
* QUIESCENT CURRENT (Iq) (500uA for all variants)
**********************
* TRANSIENT PARAMETERS
**********************
* SLEW RATE (SR)
* OVERLOAD RECOVERY TIME (tor)
******************************************************
.SUBCKT INA290A4 IN+ IN- VS GND OUT
******************************************************
.MODEL R_NOISELESS RES (T_ABS=-273.15)
C_C10         GND N1556479  1E-15
C_C11         N1557165 GND  1E-15
C_C12         GND N1557827  1E-15
C_C13         N1557907 GND  1E-15
C_C14         GND N1554397  1E-15
C_C15         N1554471 GND  1E-15
C_C16         GND N1554801  1E-15
C_C28         GND VIMON  11E-9
C_C29         GND VOUT_S  0.5E-9
C_C33         VS_B 0  1E-15
C_C35         N1555905 GND  1E-15
C_C36         GND N1558809  45P
C_C7         N1555265 GND  1E-15
C_C8         GND N1552995  1E-15
C_C9         GND N1553971  1E-15
C_CC         CLAMP GND  1.82E-9
E_E24         N1556701 N1554457 CMR GND -0.5
E_E25         N1556155 N1554973 CMR GND 0.5
E_E27         N1556161 N1556155 PSR GND 0.5
E_E28         N1556739 N1556701 PSR GND -0.5
E_E3         N1558563 GND OUT GND 1
G_G12         VSENSE GND CLAMP GND -1E-3
G_G15         CLAW_CLAMP GND N1775444 GND -1E-3
G_G16         CL_CLAMP GND CLAW_CLAMP GND -1E-3
G_G36         N1556805 0 VS 0 -1
G_G61         N1552823 GND GND IN- -1
G_G62         VICM GND IN+ N1552823 -0.5
G_G66         ACL GND CL_CLAMP GND -1
G_G8         VS_CLP GND N1552995 GND -1E-3
G_G9         GND_CLP GND N1553971 GND -1E-3
I_I_Q         VS GND DC 500E-6
R_R107         N1556805 0 R_NOISELESS 1
R_R110         N1556805 VS_B R_NOISELESS 1E-3
R_R147         N1552823 GND R_NOISELESS 1
R_R148         VICM GND R_NOISELESS 1
R_R153         GND VCM_MIN R_NOISELESS 1E9
R_R154         VCM_MAX GND R_NOISELESS 1E9
R_R155         GND N1556499 R_NOISELESS 1
R_R156         N1555905 N1556499 R_NOISELESS 1E-3
R_R157         GND ACL R_NOISELESS 1
R_R158         N1554457 N1553205  6.6K TC=0,0
R_R159         N1558809 VIMON  100 TC=0,0
R_R27         GND N1555203 R_NOISELESS 1
R_R28         N1555265 N1555203 R_NOISELESS 1E-3
R_R29         N1552917 VS_B R_NOISELESS 1E3
R_R30         N1552995 N1552917 R_NOISELESS 1E-3
R_R31         VS_CLP GND R_NOISELESS 1E3
R_R32         N1553915 GND R_NOISELESS 1E3
R_R33         N1553971 N1553915 R_NOISELESS 1E-3
R_R34         GND_CLP GND R_NOISELESS 1E3
R_R35         GND VS_CLP R_NOISELESS 1E9
R_R36         N1556407 GND R_NOISELESS 1
R_R37         N1556479 N1556407 R_NOISELESS 1E-3
R_R38         N1557165 N1557199 R_NOISELESS 1E-3
R_R39         GND N1557199 R_NOISELESS 1
R_R40         GND GND_CLP R_NOISELESS 1E9
R_R41         GND N1553787 R_NOISELESS 1E9
R_R42         N1557785 GND R_NOISELESS 1
R_R43         N1557827 N1557785 R_NOISELESS 1E-3
R_R44         N1557907 N1557939 R_NOISELESS 1E-3
R_R45         GND N1557939 R_NOISELESS 1
R_R46         GND N1552913 R_NOISELESS 1E9
R_R49         GND N1554687 R_NOISELESS 1E9
R_R50         N1554347 GND R_NOISELESS 1
R_R51         N1554397 N1554347 R_NOISELESS 1E-3
R_R52         N1554471 N1554505 R_NOISELESS 1E-3
R_R53         GND N1554505 R_NOISELESS 1
R_R54         GND N1554633 R_NOISELESS 1E9
R_R55         N1554801 VSENSE R_NOISELESS 1E-3
R_R60         GND AOL_1 R_NOISELESS 1E6
R_R61         GND CLAMP R_NOISELESS 1E6
R_R62         GND VSENSE R_NOISELESS 1E3
R_R65         GND CLAW_CLAMP R_NOISELESS 1E3
R_R66         GND CL_CLAMP R_NOISELESS 1E3
R_R81         GND N1557587 R_NOISELESS 1E9
R_R82         VIMON N1557587 R_NOISELESS 100
R_R83         GND N1558563 R_NOISELESS 1E9
R_R84         VOUT_S N1558563 R_NOISELESS 100
R_R_IN         N1555905 N1553937 R_NOISELESS 1E3
R_R_INN         N1554457 IN- R_NOISELESS 1E-6
R_R_INP         N1553205 IN+ R_NOISELESS 1E-6
R_R_IP         N1555265 N1556211 R_NOISELESS 1E3
V_VCM_MAX         VCM_MAX GND 122
V_V_GRN         N1554633 GND -28.6
V_V_GRP         N1554687 GND 25.9
V_V_ISCN         N1552913 GND -22
V_V_ISCP         N1553787 GND 13
X_AOL_1         N1556211 N1553937 GND AOL_1 AOL_1
X_AOL_2         AOL_1 GND GND CLAMP AOL_2_INA290A4 PARAMS:  GAIN=1E-2 IPOS=3.64E-3
+  INEG=-3.64E-3
X_CLAWN         GND N1558809 GND N1553915 CLAWN_INA290A4
X_CLAWP         N1558809 GND N1552917 VS_B CLAWP_INA290A4
X_CLAW_AMP         VS_CLP GND_CLP VOUT_S GND N1556407 N1557199 CLAMP_AMP_LO_INA290A4
X_CLAW_SRC         N1556479 N1557165 CLAW_CLAMP GND CLAW_SRC_INA290A4 PARAMS:  GAIN=1
+  IPOS=5.18E-2 INEG=-5.72E-2
X_CL_AMP         N1553787 N1552913 VIMON GND N1557785 N1557939 CLAMP_AMP_LO_INA290A4
X_CL_SRC         N1557827 N1557907 CL_CLAMP GND CL_SRC_INA290A4 PARAMS:  GAIN=1
+  IPOS=1.04E-1 INEG=-1.14E-1
X_GR_AMP         N1554687 N1554633 N1554801 GND N1554347 N1554505 CLAMP_AMP_HI_INA290A4
X_GR_SRC         N1554397 N1554471 CLAMP GND GR_SRC_INA290A4 PARAMS:  GAIN=1
+  IPOS=7.28E-3 INEG=-7.28E-3
X_H3    OUT N1553801 N1557587 GND 08_COMPLETE_A4_H3_INA290A4
X_IBN         N1554457 GND VICM IBN_INA290A4
X_IBP         N1553205 GND VICM IBP_INA290A4
X_P1         VSENSE GND N1775222 GND P1_INA290A4 PARAMS:  GAIN=1 FP=3.3E6 R=1E6
X_P2         N1775222 GND N1775228 GND P1_INA290A4 PARAMS:  GAIN=1 FP=3.4E6 R=10E6
X_PZ1_11         N1692190 GND N1692198 GND GND PZ1_INA290A4 PARAMS:  GAIN=1 FP=30K
+  FZ=250K R=1E4
X_PZ1_12         N1692198 GND N1692204 GND GND PZ1_INA290A4 PARAMS:  GAIN=1 FP=40K
+  FZ=280K R=10E4
X_PZ1_13         N1692204 GND N1692210 GND GND PZ1_INA290A4 PARAMS:  GAIN=1 FP=40K
+  FZ=310K R=20E4
X_PZ1_15         N1692220 GND N1692584 GND GND PZ1_INA290A4 PARAMS:  GAIN=1 FP=3E6
+  FZ=15E6 R=1E7
X_PZ1_16         N1692584 GND N1692590 GND GND PZ1_INA290A4 PARAMS:  GAIN=1 FP=4E6
+  FZ=15.6E6 R=1E8
X_U3         N1798881 GND N1798887 GND GND ZP1_INA290A4 PARAMS:  GAIN=1 FP=30E3 FZ=300
+  R=1E8
X_U30         VICM GND N1798881 GND DC_REJ_SUB_INA290A4 PARAMS:  DC_REJ=140.5 R=1
X_U4         N1798887 GND N1798893 GND GND ZP1_INA290A4 PARAMS:  GAIN=1 FP=8E6 FZ=25E3
+  R=1E8
X_U5         N1798893 GND CMR GND GND ZP1_INA290A4 PARAMS:  GAIN=1 FP=10E6 FZ=150E3
+  R=1E8
X_U57         VS_B GND N1682317 GND DC_REJ_SUB_INA290A4 PARAMS:  DC_REJ=126.024 R=1
X_U58         N1682317 GND N1682325 GND GND ZP1_INA290A4 PARAMS:  GAIN=1 FP=170K FZ=300
+  R=1E8
X_U59         N1682325 GND N1682331 GND GND ZP1_INA290A4 PARAMS:  GAIN=1 FP=190E3
+  FZ=38E3 R=1E8
X_U60         N1682331 GND N1682337 GND GND ZP1_INA290A4 PARAMS:  GAIN=1 FP=10E6
+  FZ=800E3 R=1E8
X_U61         N1682337 GND PSR GND GND ZP1_INA290A4 PARAMS:  GAIN=1 FP=12E6 FZ=1.9E6
+  R=1E8
X_U69         N1775228 GND N1775234 GND P1_INA290A4 PARAMS:  GAIN=1 FP=3.5E6 R=10E6
X_U70         N1775234 GND N1775240 GND P1_INA290A4 PARAMS:  GAIN=1 FP=3.5E6 R=20E6
X_U71         N1775240 GND N1775444 GND P1_INA290A4 PARAMS:  GAIN=1 FP=3.5E6 R=50E6
X_U72         VS_B GND VCM_MIN GND VCM_MIN_VAR_INA290A4
X_U73         N1692216 GND N1692220 GND GND ZP1_INA290A4 PARAMS:  GAIN=1 FP=3.7E6
+  FZ=1.8E6 R=1E6
X_U74         N1553205 GND N1553205 N1554457 IBP_SENSE_INA290A4 PARAMS:  RSENSE=4975
X_U75         GND N1556211 GAIN_RES_DRIFT_INA290A4 PARAMS:  G_RES=200.52E3
+  DRIFT_RES_ROOM=100 RES_DRIFT=10E-3 POL=1
X_U76         ACL N1553937 GAIN_RES_DRIFT_INA290A4 PARAMS:  G_RES=200.52E3
+  DRIFT_RES_ROOM=100 RES_DRIFT=10E-3 POL=1
X_U8         N1692210 GND N1692216 GND GND ZP1_INA290A4 PARAMS:  GAIN=1 FP=3.7E6
+  FZ=1.8E6 R=1E6
X_VCM_CLAMPN         N1556739 GND N1556499 GND VCM_MAX VCM_MIN VCM_CLAMP_INA290A4
X_VCM_CLAMPP         N1556161 GND N1555203 GND VCM_MAX VCM_MIN VCM_CLAMP_INA290A4
X_VNOISE         N1554585 N1554973 VNOISE_INA290A4 PARAMS:  NV=45
X_VOS_DRIFT         N1554585 N1553205 VOS_DRIFT_INA290A4 PARAMS:  DC=4.5E-6 DRIFT=0.2E-6
+  POL=1
X_ZOUT_DC_SUB2         ACL N1692596 N1692190 N1553801 GND ZOUT_DC_SUB_INA290A4 PARAMS:
+  ZOUT_DC=0.103 ZOUT_MAX=300
X_ZP1LIM2         N1692590 GND N1692596 GND GND ZP1LIM_INA290A4 PARAMS:  GAIN=1
+  FZ=15.6E6 FP=1E11 R=1E12 IPOS=7.8E2 INEG=-1.32E3
.ENDS  INA290A4
*
.SUBCKT 08_COMPLETE_A4_H3_INA290A4 1 2 3 4
H_H3         3 4 VH_H3 -1E3
VH_H3         1 2 0V
.ENDS  08_COMPLETE_A4_H3_INA290A4
*
.SUBCKT AOL_1 VC+ VC- IOUT+ IOUT-
+ PARAMS:
+ GAIN = 1E-4
+ IPOS = .5
+ INEG = -.5
G1 IOUT+ IOUT- VALUE={LIMIT(GAIN*V(VC+,VC-),INEG,IPOS)}
.ENDS  AOL_1
*
.SUBCKT AOL_2_INA290A4 VC+ VC- IOUT+ IOUT-
+ PARAMS:
+ GAIN = 1E-2
+ IPOS = 2.66E-02
+ INEG = -2.66E-02
G1 IOUT+ IOUT- VALUE={LIMIT(GAIN*V(VC+,VC-),INEG,IPOS)}
.ENDS  AOL_2_INA290A4
*
.SUBCKT CLAMP_AMP_HI_INA290A4 VC+ VC- VIN COM VO+ VO-
.PARAM G = 10
GVO+ COM VO+ VALUE = {IF(V(VIN,COM)>V(VC+,COM),((V(VIN,COM)-V(VC+,COM))*G),0)}
GVO- COM VO- VALUE = {IF(V(VIN,COM)<V(VC-,COM),((V(VC-,COM)-V(VIN,COM))*G),0)}
.ENDS  CLAMP_AMP_HI_INA290A4
*
.SUBCKT CLAMP_AMP_LO_INA290A4 VC+ VC- VIN COM VO+ VO-
.PARAM G = 1
GVO+ COM VO+ VALUE = {IF(V(VIN,COM)>V(VC+,COM),((V(VIN,COM)-V(VC+,COM))*G),0)}
GVO- COM VO- VALUE = {IF(V(VIN,COM)<V(VC-,COM),((V(VC-,COM)-V(VIN,COM))*G),0)}
.ENDS  CLAMP_AMP_LO_INA290A4
*
.SUBCKT CLAWN_INA290A4 VC+ VC- IOUT+ IOUT-
G1 IOUT+ IOUT- TABLE {ABS(V(VC+,VC-))} =
+(0, 14E-6)
+(1.26, 1E-4)
+(2.3, 1.8E-4)
+(5, 3.93E-4)
+(10.6, 8.6E-4)
+(15, 1.27E-3)
+(17.6, 1.546E-3)
+(20.3, 1.88E-3)
+(23.1, 2.29E-3)
.ENDS  CLAWN_INA290A4
*
.SUBCKT CLAWP_INA290A4 VC+ VC- IOUT+ IOUT-
G1 IOUT+ IOUT- TABLE {ABS(V(VC+,VC-))}
+(0, 7E-5)
+(0.76169, 1.5E-4)
+(1.13016, 1.6E-4)
+(1.669, 2.19E-4)
+(2.96314, 3.93E-4)
+(4.301, 5.81E-4)
+(6.14937, 8.6E-4)
+(8.5746, 1.27E-3)
+(11.3559, 1.88E-3)
+(13, 2.29E-3)
.ENDS  CLAWP_INA290A4
*
.SUBCKT CLAW_SRC_INA290A4 VC+ VC- IOUT+ IOUT-
+ PARAMS:
+ GAIN = 1
+ IPOS = 7E-2
+ INEG = -8.8E-2
G1 IOUT+ IOUT- VALUE={LIMIT(GAIN*V(VC+,VC-),INEG,IPOS)}
.ENDS  CLAW_SRC_INA290A4
*
.SUBCKT CL_SRC_INA290A4 VC+ VC- IOUT+ IOUT-
+ PARAMS:
+ GAIN = 1
+ IPOS = 1.4E-1
+ INEG = -1.76E-1
G1 IOUT+ IOUT- VALUE={LIMIT(GAIN*V(VC+,VC-),INEG,IPOS)}
.ENDS  CL_SRC_INA290A4
*
.SUBCKT DC_REJ_SUB_INA290A4 VC+ VC- OUT+ OUT-
+ PARAMS:
+ DC_REJ = 120
+ R = 1
.MODEL R_NOISELESS RES (T_ABS=-273.15)
.PARAM GG1 = {PWR(10, (-(DC_REJ)/20))}
G1 OUT- OUT+ VC+ VC- {GG1}
R1 OUT+ OUT- R_NOISELESS  {R}
.ENDS  DC_REJ_SUB_INA290A4
*
.SUBCKT GAIN_RES_DRIFT_INA290A4 1 2
+ PARAMS:
+ G_RES = 20E3
+ DRIFT_RES_ROOM = 100
+ RES_DRIFT = 1E-6
+ POL = 1
.MODEL R_NOISELESS RES (T_ABS=-273.15)
.MODEL R_DRIFT RES (TC1={RES_DRIFT})
R1 1 3 R_NOISELESS {G_RES-DRIFT_RES_ROOM}
R2 2 3 R_DRIFT {DRIFT_RES_ROOM}
.ENDS  GAIN_RES_DRIFT_INA290A4
*
.SUBCKT GR_SRC_INA290A4 VC+ VC- IOUT+ IOUT-
+ PARAMS:
+ GAIN = 1
+ IPOS = 5.32E-2
+ INEG = -5.32E-2
G1 IOUT+ IOUT- VALUE={LIMIT(GAIN*V(VC+,VC-),INEG,IPOS)}
.ENDS  GR_SRC_INA290A4
*
.SUBCKT IBN_INA290A4 VINN GND CM_IN
G1 VINN GND TABLE {(V(CM_IN,GND))} =
+(1, 200E-9)
+(3.5, 19.57E-6)
+(50, 19.975E-6)
+(120, 20.57E-6)
.ENDS  IBN_INA290A4
*
.SUBCKT IBP_INA290A4 VINP GND CM_IN
G1 VINP GND TABLE {(V(CM_IN,GND))} =
+(1, 225E-9)
+(3.5, 19.6E-6)
+(50, 20E-6)
+(120, 20.6E-6)
.ENDS  IBP_INA290A4
*
.SUBCKT IBP_SENSE_INA290A4 VINP GND IB+ IB-
+ PARAMS:
+ RSENSE = 23847
G1 VINP GND VALUE={(V(IB+, GND)-V(IB-,GND))/RSENSE}
.ENDS  IBP_SENSE_INA290A4
*
.SUBCKT P1_INA290A4 VC+ VC- OUT+ OUT-
+ PARAMS:
+ GAIN = 1
+ FP = 1
+ R = 1E6
.MODEL R_NOISELESS RES (T_ABS=-273.15)
.PARAM CC1 = {1/(6.2831853 * FP * R)}
.PARAM GG1 = {GAIN / R}
G1 OUT- OUT+ VC+ VC- {GG1}
R1 OUT+ OUT- R_NOISELESS {R}
C1 OUT+ OUT- {CC1}
.ENDS  P1_INA290A4
*
.SUBCKT PZ1_INA290A4 VC+ VC- OUT+ OUT- 1
+ PARAMS:
+ GAIN = 1
+ FP = 1E3
+ FZ = 1E4
+ R = 1E6
.MODEL R_NOISELESS RES (T_ABS=-273.15)
.PARAM CC1 = {1/(6.2831853 * FZ * R)}
.PARAM RR1 = {(1/(6.2831853 * FP * CC1)) - R}
C1 2 1 {CC1}
G1 OUT- OUT+ 3 1 {GAIN}
R1 VC+ 3 R_NOISELESS {RR1}
R2 3 2 R_NOISELESS {R}
R3 OUT+ OUT- R_NOISELESS 1
.ENDS  PZ1_INA290A4
*
.SUBCKT VCM_CLAMP_INA290A4 VIN+ VIN- IOUT- IOUT+ VP+ VP-
.PARAM GAIN = 1
G1 IOUT+ IOUT- VALUE={LIMIT(GAIN*V(VIN+,VIN-),V(VP-,VIN-), V(VP+,VIN-))}
.ENDS  VCM_CLAMP_INA290A4
*
.SUBCKT VCM_MIN_VAR_INA290A4 VS_IN GND VCM_ACTUAL GND
E1 VCM_ACTUAL GND TABLE {ABS(V(VS_IN,GND))} =
+(2.7, 2.50)
+(5, 2.58)
+(7.5, 3.3)
+(8.75, 3.9)
+(13.75, 5.4)
+(20, 6.88)
.ENDS  VCM_MIN_VAR_INA290A4
*
.SUBCKT VNOISE_INA290A4 1 2
+ PARAMS:
+ NV = 1E3
.PARAM RNV={1.184*PWR(NV,2)}
R4 5 0 {RNV}
R5 5 0 {RNV}
E3 1 2 5 0 10
.ENDS  VNOISE_INA290A4
*
.SUBCKT VOS_DRIFT_INA290A4 VOS+ VOS-
+ PARAMS:
+ DC = 20E-6
+ DRIFT = 1E-6
+ POL = 1
E1 VOS+ VOS- VALUE={DC+POL*DRIFT*(TEMP-27)}
.ENDS  VOS_DRIFT_INA290A4
*
.SUBCKT ZOUT_DC_SUB_INA290A4 INA INB OUTA OUTB COM
+ PARAMS:
+ ZOUT_DC = 1
+ ZOUT_MAX = 1E3
.MODEL R_NOISELESS RES (T_ABS=-273.15)
.PARAM BETA = 1
.PARAM RDUMMY = {10*ZOUT_MAX}
.PARAM RX = {100*ZOUT_MAX}
.PARAM G1 = {RX/(ZOUT_DC*BETA)}
G1 COM OUTA INA OUTB {G1}
R1 OUTA COM R_NOISELESS 1
RDUMMY OUTB COM R_NOISELESS {RDUMMY}
RX INB OUTB R_NOISELESS {RX}
.ENDS  ZOUT_DC_SUB_INA290A4
*
.SUBCKT ZP1_INA290A4 VC+ VC- OUT+ OUT- 1
+ PARAMS:
+ GAIN = 1
+ FZ = 1E3
+ FP = 1E4
+ R = 1E6
.MODEL R_NOISELESS RES (T_ABS=-273.15)
.PARAM GG1 = {GAIN * FP/FZ}
.PARAM CC1 = {1/(6.2831853 * FZ * R)}
.PARAM RR1 = {R/(FP/FZ - 1)}
C1 VC+ 2 {CC1}
G1 OUT- OUT+ 2 1 {GG1}
R1 VC+ 2 R_NOISELESS {R}
R2 2 1 R_NOISELESS {RR1}
R3 OUT+ OUT- R_NOISELESS 1
.ENDS  ZP1_INA290A4
*
.SUBCKT ZP1LIM_INA290A4 VC+ VC- OUT+ OUT- 1
+ PARAMS:
+ GAIN = 1
+ FZ = 1E3
+ FP = 1E4
+ R = 1E6
+ IPOS = 1.72E3
+ INEG = -2.9E3
.MODEL R_NOISELESS RES (T_ABS=-273.15)
.PARAM GG1 = {GAIN * FP/FZ}
.PARAM CC1 = {1/(6.2831853 * FZ * R)}
.PARAM RR1 = {R/(FP/FZ - 1)}
C1 VC+ 2 {CC1}
G1 OUT- OUT+ VALUE={LIMIT(GG1 * V(2, 1), INEG, IPOS)}
R1 VC+ 2 R_NOISELESS {R}
R2 2 1 R_NOISELESS {RR1}
R3 OUT+ OUT- R_NOISELESS 1
.ENDS  ZP1LIM_INA290A4
*
*$
* OPAx182
*****************************************************************************
* (C) Copyright 2021 Texas Instruments Incorporated. All rights reserved.
*****************************************************************************
** This model is designed as an aid for customers of Texas Instruments.
** TI and its licensors and suppliers make no warranties, either expressed
** or implied, with respect to this model, including the warranties of
** merchantability or fitness for a particular purpose.  The model is
** provided solely on an "as is" basis.  The entire risk as to its quality
** and performance is with the customer
*****************************************************************************
*
* This model is subject to change without notice. Texas Instruments
* Incorporated is not responsible for updating this model.
*
*****************************************************************************
*
** Released by: Online Design Tools, Texas Instruments Inc.
* Part: OPAx182
* Date: 25OCT2021
* Model Type: Generic (suitable for all analysis types)
* EVM Order Number: N/A
* EVM Users Guide:  N/A
* Datasheet: SBOS936C - DECEMBER 2019 - REVISED JANUARY 2021
* Created with Green-Williams-Lis Op Amp Macro-model Architecture
*
* Model Version: Final 1.1
*
*****************************************************************************
*
* Updates:
*
* Final 1.1
* 1. Modified the capacitor(C14) value from 1F to 10uF in GND Float-IQ block
*    to resolve the convergence issue in single and asymmetric supply test.
* 2. Updated PSRRp, PSRRn and CMRR curve to match the datasheet.
* 3. Updated the model name from OPA182 to OPAx182
* 4. Updated Overload recovery time and quiescent current as per the datasheet.
* 5. Updated Zo curve to match closer to datasheet.
*
* Final 1.0
* Release to Web.
*
*****************************************************************************
* Model Usage Notes:
* 1. The following parameters are modeled:
*    a. OPEN-LOOP GAIN AND PHASE VS. FREQUENCY  WITH RL, CL EFFECTS (Aol)
*    b. UNITY GAIN BANDWIDTH (GBW)
*    c. INPUT COMMON-MODE REJECTION RATIO VS. FREQUENCY (CMRR)
*    d. POWER SUPPLY REJECTION RATIO VS. FREQUENCY (PSRR)
*    e. DIFFERENTIAL INPUT IMPEDANCE (Zid)
*    f. COMMON-MODE INPUT IMPEDANCE (Zic)
*    g. OPEN-LOOP OUTPUT IMPEDANCE VS. FREQUENCY (Zo)
*    h. OUTPUT CURRENT THROUGH THE SUPPLY (Iout)
*    i. INPUT VOLTAGE NOISE DENSITY VS. FREQUENCY (en)
*    j. INPUT CURRENT NOISE DENSITY VS. FREQUENCY (in)
*    k. OUTPUT VOLTAGE SWING vs. OUTPUT CURRENT (Vo)
*    l. SHORT-CIRCUIT OUTPUT CURRENT (Isc)
*    m. QUIESCENT CURRENT (Iq)
*    n. SETTLING TIME VS. CAPACITIVE LOAD (ts)
*    o. SLEW RATE (SR)
*    p. SMALL SIGNAL OVERSHOOT VS. CAPACITIVE LOAD
*    q. LARGE SIGNAL RESPONSE
*    r. OVERLOAD RECOVERY TIME (tor)
*    s. INPUT BIAS CURRENT (Ib)
*    t. INPUT OFFSET CURRENT (Ios)
*    u. INPUT OFFSET VOLTAGE (Vos)
*    v. INPUT OFFSET VOLTAGE VS. TEMPERATURE (Vos Drift)
*    w. INPUT COMMON-MODE VOLTAGE RANGE (Vcm)
*    x. INPUT OFFSET VOLTAGE VS. INPUT COMMON-MODE VOLTAGE (Vos vs. Vcm)
*    y. INPUT/OUTPUT ESD CELLS (ESDin, ESDout)
*****************************************************************************
.SUBCKT OPAx182 IN+ IN- VCC VEE OUT
*****************************************************************************
C_C1          N3294772 N3294776  3.789N
C_C10         N3294626 N3294630  106.1U
C_C13         0 N2992397  1F
C_C14         0 N2992375  10U
C_C15         0 N2992413  1F
C_C16         N2991741 MID  1F
C_C17         N2991765 MID  1F
C_C18         N2991811 MID  1F
C_C19         N2991831 MID  1F
C_C2          N3294812 N2991579  61.21N
C_C20         N2991907 MID  1F
C_C21         N2991925 MID  1F
C_C22         MID N2991969  1F
C_C23         N2992033 MID  1F
C_C24         N2992029 MID  1F
C_C25         N2992093 MID  1P
C_C26         N2992099 MID  1P
C_C27         SW_OL_OPAx182 MID  100P
C_C29         VIMON MID  1P
C_C30         VOUT_S MID  1P
C_C4          N2991657 MID  1F
C_C5          CLAMP MID  10.53U
C_C59         N3117073 MID  530.5P
C_C66         N3805330 MID  318.3F
C_C67         N3294514 MID  5.55F
C_C68         N3805288 N3294512  26.53P
C_C70         VCLP MID  1P
C_C71         N3817523 N3817533  19.89P
C_C72         N3822166 MID  227.4P
C_C73         N3827263 MID  1.061P
C_C74         N3827249 N3828449  1.273P
C_C75         N3837270 N3837278  72.34P
C_C77         N3850714 N3850724  318.3P
C_C78         N3850734 N2991581  13.6N
C_C_COM0      ESDP MID  2.3P
C_C_COM1      MID ESDN  2.3P
C_C_DIFF      ESDN ESDP  3.7P
E_E1          MID 0 N2992375 0 1
E_E3          N2992163 MID OUT MID 1
E_E4          N3294618 MID CL_CLAMP MID 1
G_G1          N3294772 MID ESDP MID -18.96M
G_G12         CLAW_CLAMP MID N3294514 MID -1M
G_G13         CL_CLAMP MID CLAW_CLAMP MID -1M
G_G16         N3201092 MID N3294630 MID -90K
G_G18         VCC_B 0 VCC 0 -1
G_G19         VEE_B 0 VEE 0 -1
G_G2          N2991563 N2991555 N2991553 MID -1M
G_G20         VCC_CLP MID N2992033 MID -1M
G_G21         VEE_CLP MID N2992029 MID -1M
G_G22         N2992299 MID N2992295 MID -1
G_G23         N2992323 MID N2992331 MID -1
G_G3          N3294812 MID VEE_B MID -3.47
G_G35         N3805330 MID VSENSE MID -1U
G_G36         N3294514 MID N3294512 MID -1U
G_G37         N3805288 MID N3805330 MID -16.67
G_G39         N3294626 MID CL_CLAMP N2992235 -89
G_G4          N3850714 MID VCC_B MID -6.515M
G_G40         N3817597 MID N3817533 MID -3.125
G_G41         N3822072 MID N3294652 MID -1
G_G42         N3817523 MID N3822082 MID -1
G_G43         N3827249 MID N3827199 MID -1
G_G44         N3837270 MID N3294776 MID -1
G_G45         N2991553 MID N3837278 MID -1.818
G_G48         N3850734 MID N3850724 MID -128.2
G_G5          N2991587 N2991583 N2991581 N2991579 -1M
G_G6          VSENSE MID CLAMP MID -1M
I_I_B         N2991573 MID DC 50P
I_I_OS        ESDN MID DC -90P
I_I_Q         VCC VEE DC 0.85M
R_R10         MID N3294812 R_NOISELESS 1
R_R11         MID N2991579 R_NOISELESS 144M
R_R139        N3294652 N3201092 R_NOISELESS 4.99MEG
R_R140        N3117073 N3294652 R_NOISELESS 10K
R_R141        MID N3201092 R_NOISELESS 1
R_R15         N2991583 N2991563 R_NOISELESS 1M
R_R16         N2991587 N2991583 R_NOISELESS 1K
R_R161        MID N3805330 R_NOISELESS 1MEG
R_R162        MID N3294514 R_NOISELESS 1MEG
R_R163        N3294512 N3805288 R_NOISELESS 10K
R_R164        MID N3805288 R_NOISELESS 1
R_R165        MID N3294512 R_NOISELESS 638.3
R_R167        N3294618 VCLP R_NOISELESS 100
R_R168        N3817533 N3817523 R_NOISELESS 10K
R_R169        MID N3817523 R_NOISELESS 1
R_R17         N2991619 ESDN R_NOISELESS 1M
R_R170        MID N3817533 R_NOISELESS 4.706K
R_R171        N3822082 N3822072 R_NOISELESS 223.3K
R_R172        N3822166 N3822082 R_NOISELESS 10K
R_R173        MID N3822072 R_NOISELESS 1
R_R174        N3827199 N3817597 R_NOISELESS 11.43K
R_R175        N3827263 N3827199 R_NOISELESS 10K
R_R176        MID N3827249 R_NOISELESS 1
R_R177        MID N3817597 R_NOISELESS 1
R_R178        N3828449 N3827249 R_NOISELESS 10K
R_R179        MID N3828449 R_NOISELESS 1.282K
R_R18         MID N2991623 R_NOISELESS 1T
R_R180        N3837278 N3837270 R_NOISELESS 10K
R_R181        MID N3837270 R_NOISELESS 1
R_R182        MID N3837278 R_NOISELESS 12.22K
R_R183        MID N2991553 R_NOISELESS 1
R_R187        N3850724 N3850714 R_NOISELESS 100MEG
R_R188        N2991581 N3850734 R_NOISELESS 10K
R_R189        MID N3850714 R_NOISELESS 1
R_R19         MID N2991635 R_NOISELESS 1T
R_R190        MID N3850724 R_NOISELESS 76.92
R_R191        MID N3850734 R_NOISELESS 1
R_R192        MID N2991581 R_NOISELESS 78.61
R_R20         N2991643 MID R_NOISELESS 1
R_R21         N2991657 N2991643 R_NOISELESS 1M
R_R22         MID N2991667 R_NOISELESS 1MEG
R_R23         MID CLAMP R_NOISELESS 1MEG
R_R24         MID VSENSE R_NOISELESS 1K
R_R32         MID CLAW_CLAMP R_NOISELESS 1K
R_R33         MID CL_CLAMP R_NOISELESS 1K
R_R34         N3294630 N3294626 R_NOISELESS 100K
R_R35         MID N3294626 R_NOISELESS 1
R_R36         MID N3294630 R_NOISELESS 1.111
R_R43         MID N3294682 R_NOISELESS 1
R_R46         VCC_B 0 R_NOISELESS 1
R_R47         VCC_B N2992397 R_NOISELESS 1M
R_R48         N2992397 N2992375 R_NOISELESS 1MEG
R_R49         N2992375 0 R_NOISELESS 1T
R_R5          MID N3294772 R_NOISELESS 1
R_R50         N2992375 N2992413 R_NOISELESS 1MEG
R_R51         N2992413 VEE_B R_NOISELESS 1M
R_R52         VEE_B 0 R_NOISELESS 1
R_R53         VCC_CLP MID R_NOISELESS 1T
R_R54         N2991729 MID R_NOISELESS 1
R_R55         N2991741 N2991729 R_NOISELESS 1M
R_R56         VEE_CLP MID R_NOISELESS 1T
R_R57         N2991763 MID R_NOISELESS 1
R_R58         N2991765 N2991763 R_NOISELESS 1M
R_R59         N2991807 MID R_NOISELESS 1T
R_R6          N3294776 N3294772 R_NOISELESS 100MEG
R_R60         N2991809 MID R_NOISELESS 1
R_R61         N2991811 N2991809 R_NOISELESS 1M
R_R62         N2991831 N2991837 R_NOISELESS 1M
R_R63         N2991849 MID R_NOISELESS 1T
R_R64         N2991837 MID R_NOISELESS 1
R_R65         N2991901 MID R_NOISELESS 1T
R_R66         N2991905 MID R_NOISELESS 1
R_R67         N2991907 N2991905 R_NOISELESS 1M
R_R68         N2991925 N2991931 R_NOISELESS 1M
R_R69         N2991943 MID R_NOISELESS 1T
R_R7          MID N3294776 R_NOISELESS 21
R_R70         N2991931 MID R_NOISELESS 1
R_R71         N2991969 VSENSE R_NOISELESS 1M
R_R72         VCC_B N2991997 R_NOISELESS 1K
R_R73         N2991997 N2992033 R_NOISELESS 1M
R_R74         N2992001 VEE_B R_NOISELESS 1K
R_R75         N2992001 N2992029 R_NOISELESS 1M
R_R76         MID VCC_CLP R_NOISELESS 1K
R_R77         VEE_CLP MID R_NOISELESS 1K
R_R78         N2992323 MID R_NOISELESS 1
R_R79         N2992299 MID R_NOISELESS 1
R_R8          N2991563 N2991555 R_NOISELESS 1K
R_R80         V11 N2992093 R_NOISELESS 100
R_R81         V12 N2992099 R_NOISELESS 100
R_R82         N2992105 MID R_NOISELESS 1
R_R83         N2992105 SW_OL_OPAx182 R_NOISELESS 100
R_R9          N2991579 N3294812 R_NOISELESS 100MEG
R_RDUMMY      MID N2992235 R_NOISELESS 20.1238K
R_RS_INN      IN- ESDN R_NOISELESS 10M
R_RS_INP      IN+ ESDP R_NOISELESS 10M
R_RX          N2992235 N3294682 R_NOISELESS 201.238K
R_RX1         MID N2992151 R_NOISELESS 1T
R_RX2         VIMON N2992151 R_NOISELESS 100
R_RX3         MID N2992163 R_NOISELESS 1T
R_RX4         VOUT_S N2992163 R_NOISELESS 100
R_R_CM1       ESDP MID R_NOISELESS 1T
R_R_CM2       MID ESDN R_NOISELESS 1T
R_R_DIFF      ESDN ESDP R_NOISELESS 100MEG
V_VCM_MAX     N2991623 VCC_B -2.5
V_VCM_MIN     N2991635 VEE_B -0.1
V_V_GRN       N2991943 MID -200
V_V_GRP       N2991901 MID 200
V_V_ISCN      N2991849 MID -70.5
V_V_ISCP      N2991807 MID 65
V_V_ORN       N2992295 VCLP -10E-6
V_V_ORP       N2992331 VCLP 10E-6
X_H1          N2992235 OUT N2992151 MID BLOCK_DC_H1_OPAx182
X_H2          N2992287 N2992323 V12 MID BLOCK_DC_H2_OPAx182
X_H3          N2992267 N2992299 V11 MID BLOCK_DC_H3_OPAx182
X_S1          N2992267 CLAMP N2992267 CLAMP BLOCK_DC_S1_OPAx182
X_S2          CLAMP N2992287 CLAMP N2992287 BLOCK_DC_S2_OPAx182
X_U10         VCC_CLP VEE_CLP VOUT_S MID N2991729 N2991763 CLAMP_AMP_LO_OPAx182 PARAMS:
+  G=1
X_U11         N2991807 N2991849 VIMON MID N2991809 N2991837 CLAMP_AMP_LO_OPAx182
+  PARAMS: G=1
X_U12         N2991901 N2991943 N2991969 MID N2991905 N2991931 CLAMP_AMP_HI_OPAx182
+  PARAMS: G=10
X_U16         MID N2992105 N2992093 N2992099 OL_SENSE_OPAx182
X_U18         VIMON MID N2991997 VCC_B CLAWP_OPAx182
X_U19         MID VIMON VEE_B N2992001 CLAWN_OPAx182
X_U21         OUT VCC VEE ESD_OUT_OPAx182
X_U22         N2991811 N2991831 CL_CLAMP MID CL_SRC_OPAx182 PARAMS: GAIN=1 IPOS=0.8E1
+  INEG=-0.8E1
X_U23         N2991907 N2991925 CLAMP MID GR_SRC_OPAx182 PARAMS: GAIN=1 IPOS=250E1
+  INEG=-250E1
X_U25         SW_OL_OPAx182 MID N3294626 N3294630 SW_OL_OPAx182
X_U26         VIMON MID VCC MID IQ_SRC_OPAx182 PARAMS: GAIN=1E-3
X_U27         MID VIMON MID VEE IQ_SRC_OPAx182 PARAMS: GAIN=1E-3
X_U30         N2991657 N2991619 MID N2991667 AOL_1_OPAx182 PARAMS: GAIN=1E-4 IPOS=.5
+  INEG=-.5
X_U31         N2991667 MID MID CLAMP AOL_2_OPAx182 PARAMS: GAIN=3.289 IPOS=125
+  INEG=-125
X_U32         N3828449 MID MID N3294682 ZO_SRC_OPAx182 PARAMS: GAIN=8.8 IPOS=30E5
+  INEG=-30E5
X_U35         N2991741 N2991765 CLAW_CLAMP MID CLAW_SRC_OPAx182 PARAMS: GAIN=1
+  IPOS=0.4E1 INEG=-0.4E1
X_U36         N2991573 MID FEMT_OPAx182 PARAMS: NVRF=166.57
X_U37         ESDN MID FEMT_OPAx182 PARAMS: NVRF=166.57
X_U4         N2991555 N2991573 VOS_DRIFT_OPAx182 PARAMS: DC=2.69871E-7 POL=1
+  DRIFT=0.003E-6
X_U40         ESDP N2991573 VNSE_OPAx182 PARAMS: NVR=5.755
X_U5          ESDN ESDP VCC VEE ESD_IN_OPAx182
X_U6          N2991587 MID N2991643 MID N2991623 N2991635 VCM_CLAMP_OPAx182 PARAMS:
+  GAIN=1
.ENDS OPAx182
*
.SUBCKT BLOCK_DC_H1_OPAx182 1 2 3 4
H_H1         3 4 VH_H1 1K
VH_H1         1 2 0V
.ENDS  BLOCK_DC_H1_OPAx182
*
.SUBCKT BLOCK_DC_H2_OPAx182 1 2 3 4
H_H2         3 4 VH_H2 1
VH_H2         1 2 0V
.ENDS  BLOCK_DC_H2_OPAx182
*
.SUBCKT BLOCK_DC_H3_OPAx182 1 2 3 4
H_H3         3 4 VH_H3 -1
VH_H3         1 2 0V
.ENDS  BLOCK_DC_H3_OPAx182
*
.SUBCKT BLOCK_DC_S1_OPAx182 1 2 3 4
S_S1         3 4 1 2 _S1
RS_S1         1 2 1G
.MODEL         _S1 VSWITCH ROFF=1E12 RON=10M VOFF=0.0V VON=10MV
.ENDS  BLOCK_DC_S1_OPAx182
*
.SUBCKT BLOCK_DC_S2_OPAx182 1 2 3 4
S_S2         3 4 1 2 _S2
RS_S2         1 2 1G
.MODEL         _S2 VSWITCH ROFF=1E12 RON=10M VOFF=0.0V VON=10MV
.ENDS  BLOCK_DC_S2_OPAx182
*
.SUBCKT AOL_1_OPAx182 VC+ VC- IOUT+ IOUT- PARAMS: GAIN=1E-4 IPOS=.5 INEG=-.5
G1 IOUT+ IOUT- VALUE={LIMIT(GAIN*V(VC+,VC-),INEG,IPOS)}
.ENDS  AOL_1_OPAx182
*
.SUBCKT AOL_2_OPAx182 VC+ VC- IOUT+ IOUT- PARAMS: GAIN=3.289 IPOS=125 INEG=-125
G1 IOUT+ IOUT- VALUE={LIMIT(GAIN*V(VC+,VC-),INEG,IPOS)}
.ENDS  AOL_2_OPAx182
*
.SUBCKT CLAMP_AMP_HI_OPAx182 VC+ VC- VIN COM VO+ VO- PARAMS: G=10
GVO+ COM VO+ VALUE = {IF(V(VIN,COM)>V(VC+,COM),((V(VIN,COM)-V(VC+,COM))*G),0)}
GVO- COM VO- VALUE = {IF(V(VIN,COM)<V(VC-,COM),((V(VC-,COM)-V(VIN,COM))*G),0)}
.ENDS  CLAMP_AMP_HI_OPAx182
*
.SUBCKT CLAMP_AMP_LO_OPAx182 VC+ VC- VIN COM VO+ VO- PARAMS: G=1
GVO+ COM VO+ VALUE = {IF(V(VIN,COM)>V(VC+,COM),((V(VIN,COM)-V(VC+,COM))*G),0)}
GVO- COM VO- VALUE = {IF(V(VIN,COM)<V(VC-,COM),((V(VC-,COM)-V(VIN,COM))*G),0)}
.ENDS  CLAMP_AMP_LO_OPAx182
*
.SUBCKT CLAWN_OPAx182 VC+ VC- IOUT+ IOUT-
G1 IOUT+ IOUT- TABLE {(V(VC+,VC-))} =
+(0,    1.00E-6)
+(12,   5.07E-4)
+(24,   1.09E-3)
+(36,   1.59E-3)
+(48,   2.26E-3)
+(60,   2.86E-3)
+(66,   3.17E-3)
+(69.2, 3.36E-3)
+(70.5, 1.80E-2)
.ENDS  CLAWN_OPAx182
*
.SUBCKT CLAWP_OPAx182 VC+ VC- IOUT+ IOUT-
G1 IOUT+ IOUT- TABLE {(V(VC+,VC-))} =
+(0,   1.00E-6)
+(12,  4.55E-4)
+(24,  1.08E-3)
+(33,  1.42E-3)
+(42,  1.96E-3)
+(51,  2.57E-3)
+(57,  3.07E-3)
+(60,  3.42E-3)
+(63,  3.79E-3)
+(65,  1.80E-2)
.ENDS  CLAWP_OPAx182
*
.SUBCKT CLAW_SRC_OPAx182 VC+ VC- IOUT+ IOUT- PARAMS: GAIN=1 IPOS=0.4E1 INEG=-0.4E1
G1 IOUT+ IOUT- VALUE={LIMIT(GAIN*V(VC+,VC-),INEG,IPOS)}
.ENDS  CLAW_SRC_OPAx182
*
.SUBCKT CL_SRC_OPAx182 VC+ VC- IOUT+ IOUT- PARAMS: GAIN=1 IPOS=0.8E1 INEG=-0.8E1
G1 IOUT+ IOUT- VALUE={LIMIT(GAIN*V(VC+,VC-),INEG,IPOS)}
.ENDS  CL_SRC_OPAx182
*
.SUBCKT ESD_IN_OPAx182 ESDN ESDP VCC VEE
.MODEL ESD_SW VSWITCH(RON=50 ROFF=1E12 VON=500E-3 VOFF=450E-3)
S1 ESDN VCC ESDN VCC ESD_SW
S2 ESDP VCC ESDP VCC ESD_SW
S3 VEE ESDN VEE ESDN ESD_SW
S4 VEE ESDP VEE ESDP ESD_SW
.ENDS  ESD_IN_OPAx182
*
.SUBCKT ESD_OUT_OPAx182 OUT VCC VEE
.MODEL ESD_SW VSWITCH(RON=50 ROFF=1E12 VON=500E-3 VOFF=450E-3)
S1 OUT VCC OUT VCC ESD_SW
S2 VEE OUT VEE OUT ESD_SW
.ENDS  ESD_OUT_OPAx182
*
.SUBCKT FEMT_OPAx182 1 2 PARAMS: NVRF=166.57
E1 3 0 5 0 10
R1 5 0 {1.184*PWR(NVRF,2)}
R2 5 0 {1.184*PWR(NVRF,2)}
G1 1 2 3 0 1E-6
.ENDS  FEMT_OPAx182
*
.SUBCKT GR_SRC_OPAx182 VC+ VC- IOUT+ IOUT- PARAMS: GAIN=1 IPOS=250E1 INEG=-250E1
G1 IOUT+ IOUT- VALUE={LIMIT(GAIN*V(VC+,VC-),INEG,IPOS)}
.ENDS  GR_SRC_OPAx182
*
.SUBCKT IQ_SRC_OPAx182 VC+ VC- IOUT+ IOUT- PARAMS: GAIN=1E-3
G1 IOUT+ IOUT- VALUE={IF( (V(VC+,VC-)<=0),0,GAIN*V(VC+,VC-) )}
.ENDS  IQ_SRC_OPAx182
*
.SUBCKT OL_SENSE_OPAx182 COM SW+ OLN OLP
GSW+ COM SW+ VALUE = {IF((V(OLN,COM)>10E-3 | V(OLP,COM)>10E-3),1,0)}
.ENDS  OL_SENSE_OPAx182
*
.SUBCKT SW_OL_OPAx182 SW_OL_OPAx182 MID CAP_L CAP_R
.MODEL OL_SW VSWITCH(RON=1E-3 ROFF=1E12 VON=900E-3 VOFF=800E-3)
S1 CAP_L CAP_R SW_OL_OPAx182 MID OL_SW
.ENDS  SW_OL_OPAx182
*
.SUBCKT VCM_CLAMP_OPAx182 VIN+ VIN- IOUT- IOUT+ VP+ VP- PARAMS: GAIN=1